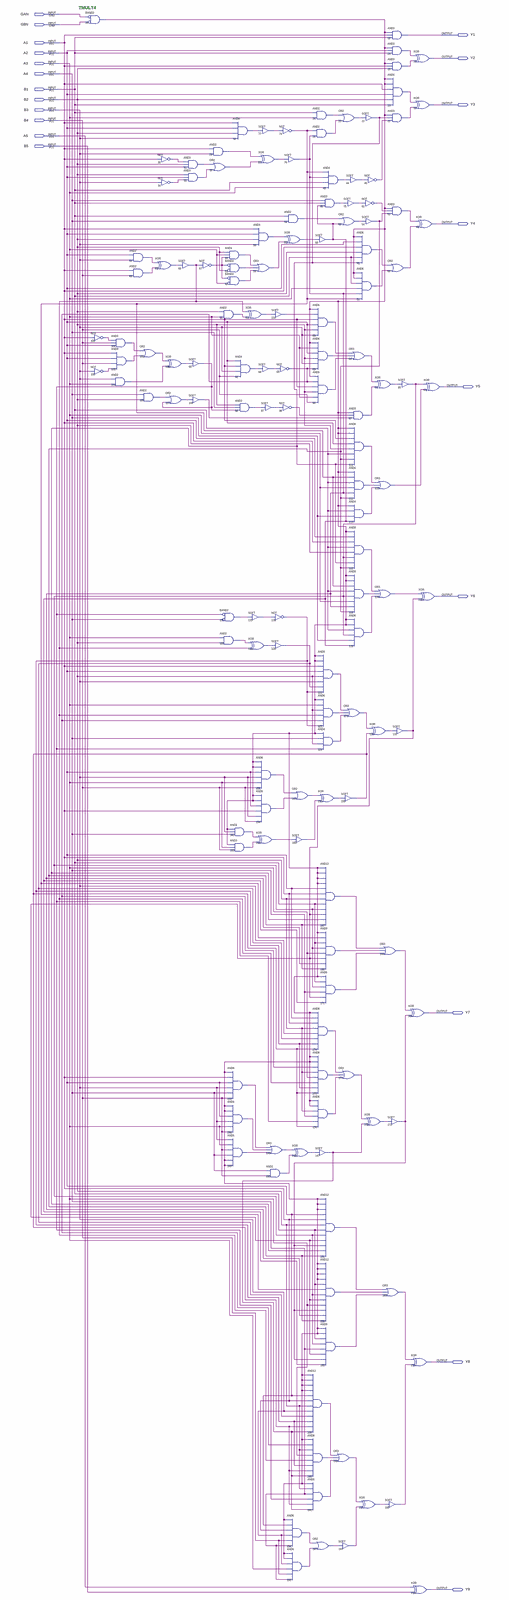
[diagram p0: schematic sheet, whole]
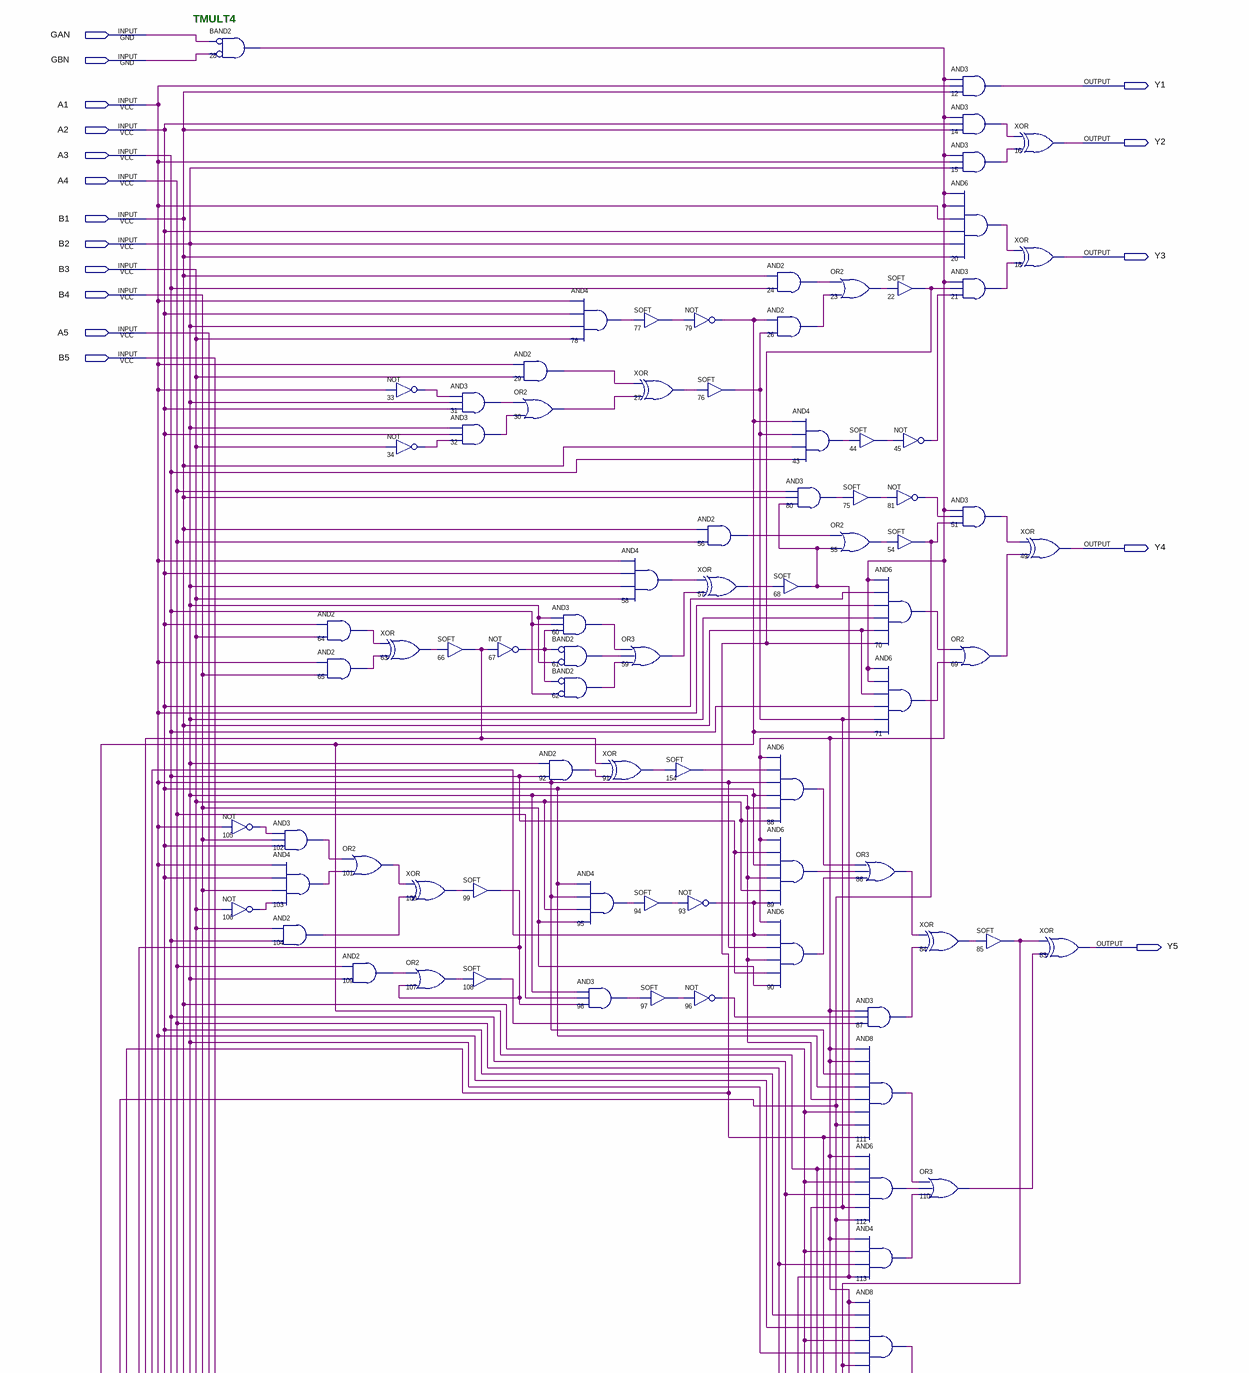
[diagram p1: schematic sheet, upper part]
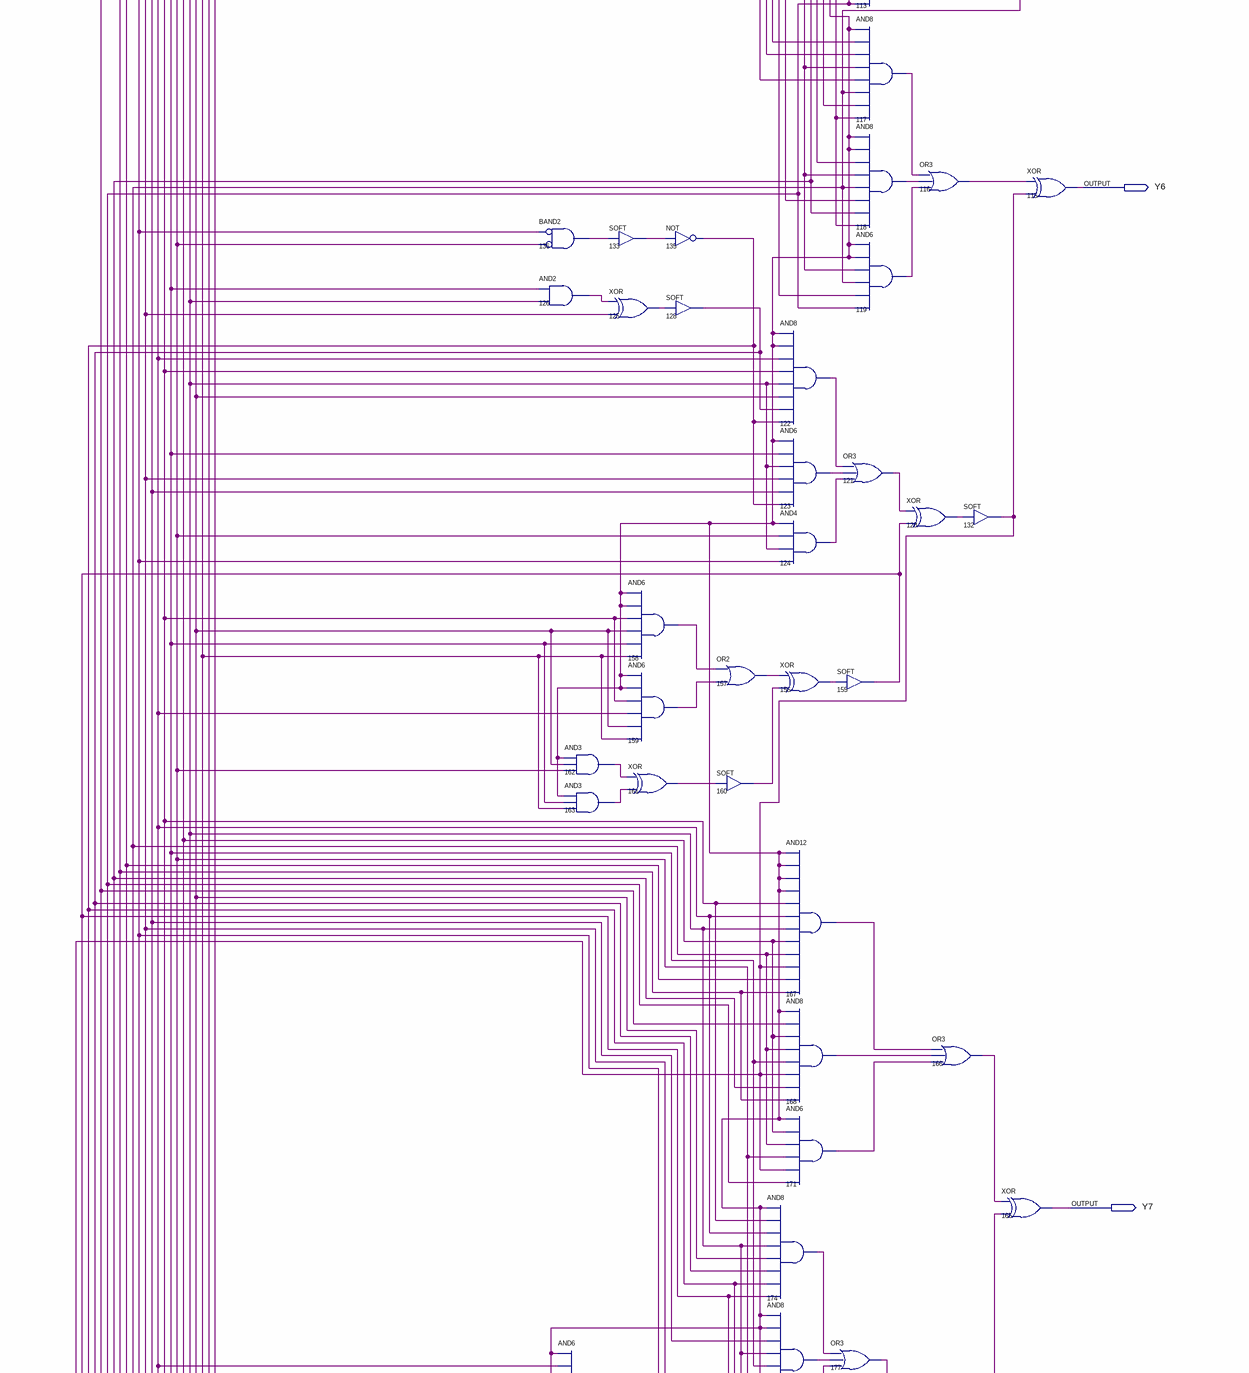
[diagram p2: schematic sheet, middle part]
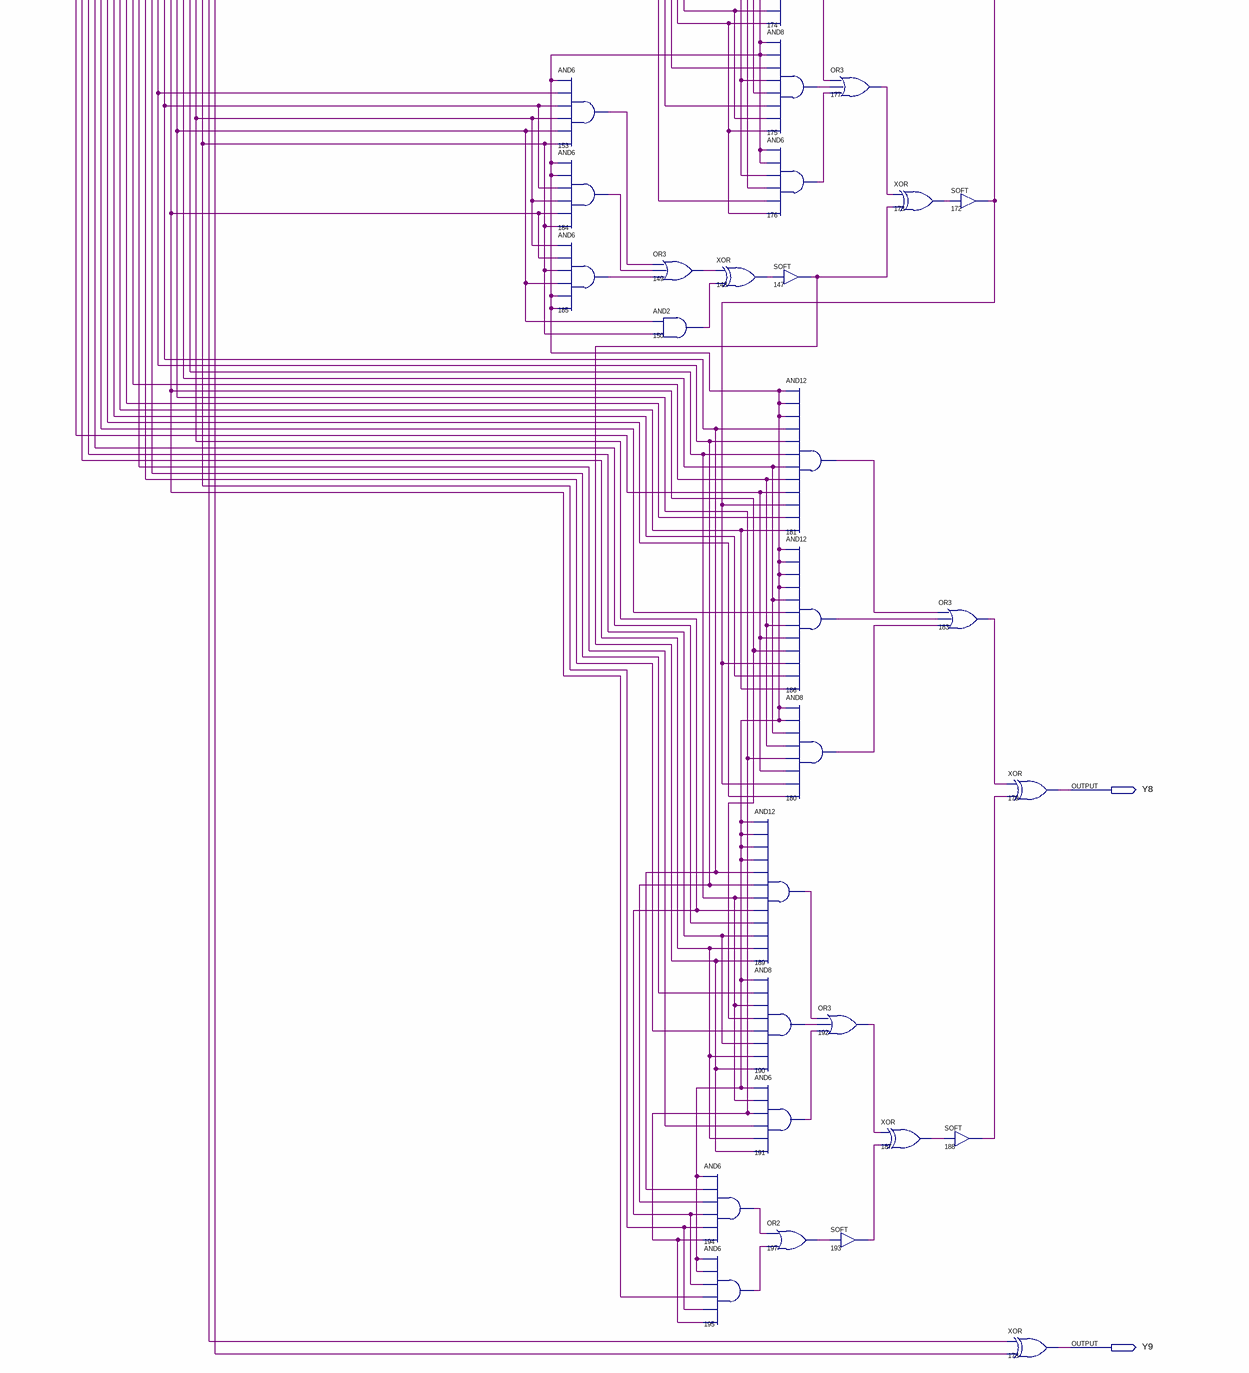
[diagram p3: schematic sheet, lower part]
// Quartus schematic tmult4.bdf as structural Verilog: 141 symbols, 21 pins
module tmult4 (
  input  GAN,
  input  GBN,
  input  A1,
  input  A2,
  input  A3,
  input  A4,
  input  B1,
  input  B2,
  input  B3,
  input  B4,
  input  A5,
  input  B5,
  output Y1,
  output Y2,
  output Y3,
  output Y4,
  output Y5,
  output Y6,
  output Y7,
  output Y8,
  output Y9
);

  wire n14_out, n15_out, n20_out, n21_out, n22_out, n23_out, n24_out, n26_out, n27_out, n28_out, n29_out,
       n30_out, n31_out, n32_out, n33_out, n34_out, n43_out, n44_out, n45_out, n51_out, n54_out, n55_out,
       n56_out, n57_out, n58_out, n59_out, n60_out, n61_out, n62_out, n63_out, n64_out, n65_out, n66_out,
       n67_out, n68_out, n69_out, n70_out, n71_out, n75_out, n76_out, n77_out, n78_out, n79_out, n80_out,
       n81_out, n84_out, n85_out, n86_out, n87_out, n88_out, n89_out, n90_out, n91_out, n92_out, n93_out,
       n94_out, n95_out, n96_out, n97_out, n98_out, n99_out, n100_out, n101_out, n102_out, n103_out,
       n104_out, n105_out, n106_out, n107_out, n108_out, n109_out, n110_out, n111_out, n112_out, n113_out,
       n116_out, n117_out, n118_out, n119_out, n120_out, n121_out, n122_out, n123_out, n124_out, n125_out,
       n126_out, n128_out, n132_out, n133_out, n135_out, n136_out, n147_out, n148_out, n149_out, n150_out,
       n153_out, n154_out, n155_out, n156_out, n157_out, n158_out, n159_out, n160_out, n161_out, n162_out,
       n163_out, n166_out, n167_out, n168_out, n171_out, n172_out, n173_out, n174_out, n175_out, n176_out,
       n177_out, n180_out, n181_out, n183_out, n184_out, n185_out, n186_out, n187_out, n188_out, n189_out,
       n190_out, n191_out, n192_out, n193_out, n194_out, n195_out, n197_out;

  and u_28 (n28_out, ~GAN, ~GBN);  // BAND2
  not u_105 (n105_out, A1);
  not u_106 (n106_out, B3);
  and u_102 (n102_out, n105_out, B4, A2);
  and u_103 (n103_out, A1, A2, B4, n106_out);
  and u_104 (n104_out, B3, A3);
  and u_64 (n64_out, A2, B3);
  and u_65 (n65_out, A1, B4);
  or u_101 (n101_out, n102_out, n103_out);
  and u_109 (n109_out, A4, B2);
  not u_33 (n33_out, A1);
  not u_34 (n34_out, B3);
  xor u_63 (n63_out, n64_out, n65_out);
  xor u_100 (n100_out, n101_out, n104_out);
  or u_107 (n107_out, n109_out, n99_out);
  and u_31 (n31_out, n33_out, B2, A2);
  and u_32 (n32_out, B2, A2, n34_out);
  SOFT u_66 (.IN(n63_out), .OUT(n66_out));
  SOFT u_99 (.IN(n100_out), .OUT(n99_out));
  SOFT u_108 (.IN(n107_out), .OUT(n108_out));
  and u_29 (n29_out, A1, B3);
  or u_30 (n30_out, n31_out, n32_out);
  not u_67 (n67_out, n66_out);
  and u_60 (n60_out, B2, A3, n67_out);
  and u_61 (n61_out, ~n67_out, ~B2);  // BAND2
  and u_62 (n62_out, ~n67_out, ~A3);  // BAND2
  and u_92 (n92_out, B2, A3);
  and u_136 (n136_out, ~n99_out, ~A4);  // BAND2
  and u_126 (n126_out, A3, B2);
  and u_162 (n162_out, n28_out, B3, A4);
  and u_163 (n163_out, n28_out, A3, B4);
  and u_153 (n153_out, n28_out, A1, A2, B3, A4, B4);
  and u_184 (n184_out, n28_out, n28_out, A2, B3, A3, B4);
  and u_185 (n185_out, B3, A3, B4, A4, n28_out, n28_out);
  and u_78 (n78_out, A1, A2, B2, B3);
  xor u_91 (n91_out, n66_out, n92_out);
  and u_95 (n95_out, A2, A1, B3, B4);
  and u_98 (n98_out, B2, A4, n99_out);
  SOFT u_133 (.IN(n136_out), .OUT(n133_out));
  xor u_125 (n125_out, n126_out, n66_out);
  SOFT u_77 (.IN(n78_out), .OUT(n77_out));
  xor u_27 (n27_out, n29_out, n30_out);
  and u_58 (n58_out, A1, A2, B2, B3);
  or u_59 (n59_out, n60_out, n61_out, n62_out);
  SOFT u_154 (.IN(n91_out), .OUT(n154_out));
  SOFT u_94 (.IN(n95_out), .OUT(n94_out));
  SOFT u_97 (.IN(n98_out), .OUT(n97_out));
  not u_135 (n135_out, n133_out);
  SOFT u_128 (.IN(n125_out), .OUT(n128_out));
  and u_158 (n158_out, n28_out, n28_out, A2, B3, A3, B4);
  and u_159 (n159_out, n28_out, n28_out, A2, A1, B3, B4);
  xor u_161 (n161_out, n162_out, n163_out);
  or u_149 (n149_out, n153_out, n184_out, n185_out);
  and u_150 (n150_out, A4, B4);
  not u_79 (n79_out, n77_out);
  SOFT u_76 (.IN(n27_out), .OUT(n76_out));
  and u_56 (n56_out, B1, A4);
  xor u_57 (n57_out, n58_out, n59_out);
  not u_93 (n93_out, n94_out);
  not u_96 (n96_out, n97_out);
  or u_157 (n157_out, n158_out, n159_out);
  SOFT u_160 (.IN(n161_out), .OUT(n160_out));
  xor u_148 (n148_out, n149_out, n150_out);
  and u_194 (n194_out, n28_out, A2, A1, B3, B4, A4);
  and u_195 (n195_out, n28_out, n28_out, B3, A3, B4, A4);
  and u_24 (n24_out, B1, A3);
  and u_26 (n26_out, n79_out, n76_out);
  and u_88 (n88_out, n28_out, n154_out, A1, A2, B2, B3);
  and u_89 (n89_out, n28_out, A3, A2, B2, B3, n93_out);
  and u_90 (n90_out, n28_out, n93_out, A1, B2, A3, B4);
  and u_174 (n174_out, n28_out, A2, A1, B2, B3, n128_out, n135_out, n155_out);
  and u_175 (n175_out, n28_out, n28_out, n93_out, B2, A3, n66_out, n135_out, n155_out);
  and u_176 (n176_out, n28_out, n28_out, B2, A4, n99_out, n155_out);
  and u_189 (n189_out, n28_out, n28_out, n28_out, n28_out, A2, A1, B2, B3, n128_out, n135_out, n155_out, n147_out);
  and u_190 (n190_out, n28_out, n93_out, B2, A3, n66_out, n135_out, n155_out, n147_out);
  and u_191 (n191_out, n28_out, B2, A4, n99_out, n155_out, n147_out);
  or u_197 (n197_out, n194_out, n195_out);
  and u_43 (n43_out, n79_out, n76_out, B1, A3);
  and u_80 (n80_out, A4, B1, n68_out);
  SOFT u_68 (.IN(n57_out), .OUT(n68_out));
  and u_122 (n122_out, n28_out, n28_out, A1, A2, B2, B3, n128_out, n135_out);
  and u_123 (n123_out, n28_out, A3, B2, n66_out, n93_out, n135_out);
  and u_124 (n124_out, n28_out, A4, B2, n99_out);
  xor u_156 (n156_out, n157_out, n160_out);
  and u_167 (n167_out, n28_out, n28_out, n28_out, n28_out, A2, A1, B2, B1, n85_out, n132_out, n22_out, n54_out);
  and u_168 (n168_out, n28_out, n79_out, B1, n85_out, A3, n132_out, n76_out, n54_out);
  and u_171 (n171_out, n28_out, B1, n85_out, A4, n132_out, n68_out);
  SOFT u_147 (.IN(n148_out), .OUT(n147_out));
  and u_181 (n181_out, n28_out, n28_out, n28_out, A2, A1, B2, B1, n85_out, n132_out, n172_out, n22_out, n54_out);
  and u_186 (n186_out, n28_out, n28_out, n28_out, n28_out, B1, n79_out, n85_out, n132_out, A3, n172_out, n76_out, n54_out);
  and u_180 (n180_out, n28_out, n28_out, B1, n85_out, A4, n132_out, n172_out, n68_out);
  or u_192 (n192_out, n189_out, n190_out, n191_out);
  or u_23 (n23_out, n24_out, n26_out);
  SOFT u_44 (.IN(n43_out), .OUT(n44_out));
  SOFT u_75 (.IN(n80_out), .OUT(n75_out));
  or u_55 (n55_out, n56_out, n68_out);
  or u_86 (n86_out, n88_out, n89_out, n90_out);
  and u_87 (n87_out, n28_out, n96_out, n108_out);
  and u_111 (n111_out, n28_out, n28_out, A1, A2, B2, B1, n54_out, n22_out);
  and u_112 (n112_out, n28_out, n79_out, B1, A3, n76_out, n54_out);
  and u_113 (n113_out, n28_out, B1, A4, n68_out);
  and u_117 (n117_out, n28_out, A2, A1, B1, B2, n85_out, n22_out, n54_out);
  and u_118 (n118_out, n28_out, n28_out, n79_out, B1, n85_out, A3, n76_out, n54_out);
  and u_119 (n119_out, n28_out, n28_out, B1, n85_out, A4, n68_out);
  or u_121 (n121_out, n122_out, n123_out, n124_out);
  SOFT u_155 (.IN(n156_out), .OUT(n155_out));
  or u_177 (n177_out, n174_out, n175_out, n176_out);
  SOFT u_193 (.IN(n197_out), .OUT(n193_out));
  SOFT u_22 (.IN(n23_out), .OUT(n22_out));
  not u_45 (n45_out, n44_out);
  not u_81 (n81_out, n75_out);
  SOFT u_54 (.IN(n55_out), .OUT(n54_out));
  and u_70 (n70_out, n28_out, A2, A1, B2, B1, n22_out);
  and u_71 (n71_out, n28_out, n28_out, B1, A3, n76_out, n79_out);
  xor u_84 (n84_out, n86_out, n87_out);
  or u_110 (n110_out, n111_out, n112_out, n113_out);
  or u_116 (n116_out, n117_out, n118_out, n119_out);
  xor u_120 (n120_out, n121_out, n155_out);
  xor u_173 (n173_out, n177_out, n147_out);
  xor u_187 (n187_out, n192_out, n193_out);
  and u_12 (Y1, n28_out, A1, B1);
  and u_14 (n14_out, n28_out, A2, B1);
  and u_15 (n15_out, n28_out, A1, B2);
  and u_20 (n20_out, n28_out, n28_out, A1, A2, B2, B1);
  and u_21 (n21_out, n28_out, n22_out, n45_out);
  and u_51 (n51_out, n28_out, n81_out, n54_out);
  or u_69 (n69_out, n70_out, n71_out);
  SOFT u_132 (.IN(n120_out), .OUT(n132_out));
  or u_166 (n166_out, n167_out, n168_out, n171_out);
  SOFT u_172 (.IN(n173_out), .OUT(n172_out));
  or u_183 (n183_out, n181_out, n186_out, n180_out);
  SOFT u_188 (.IN(n187_out), .OUT(n188_out));
  xor u_16 (Y2, n14_out, n15_out);
  xor u_18 (Y3, n20_out, n21_out);
  xor u_49 (Y4, n51_out, n69_out);
  SOFT u_85 (.IN(n84_out), .OUT(n85_out));
  xor u_165 (Y7, n166_out, n172_out);
  xor u_179 (Y8, n183_out, n188_out);
  xor u_178 (Y9, A5, B5);
  xor u_83 (Y5, n85_out, n110_out);
  xor u_115 (Y6, n116_out, n132_out);

  // Notes on the sheet:
  //   TMULT4
endmodule
